# EAGLE design BLL-EBOOK-RpiZero (EAGLE 9.6.2)
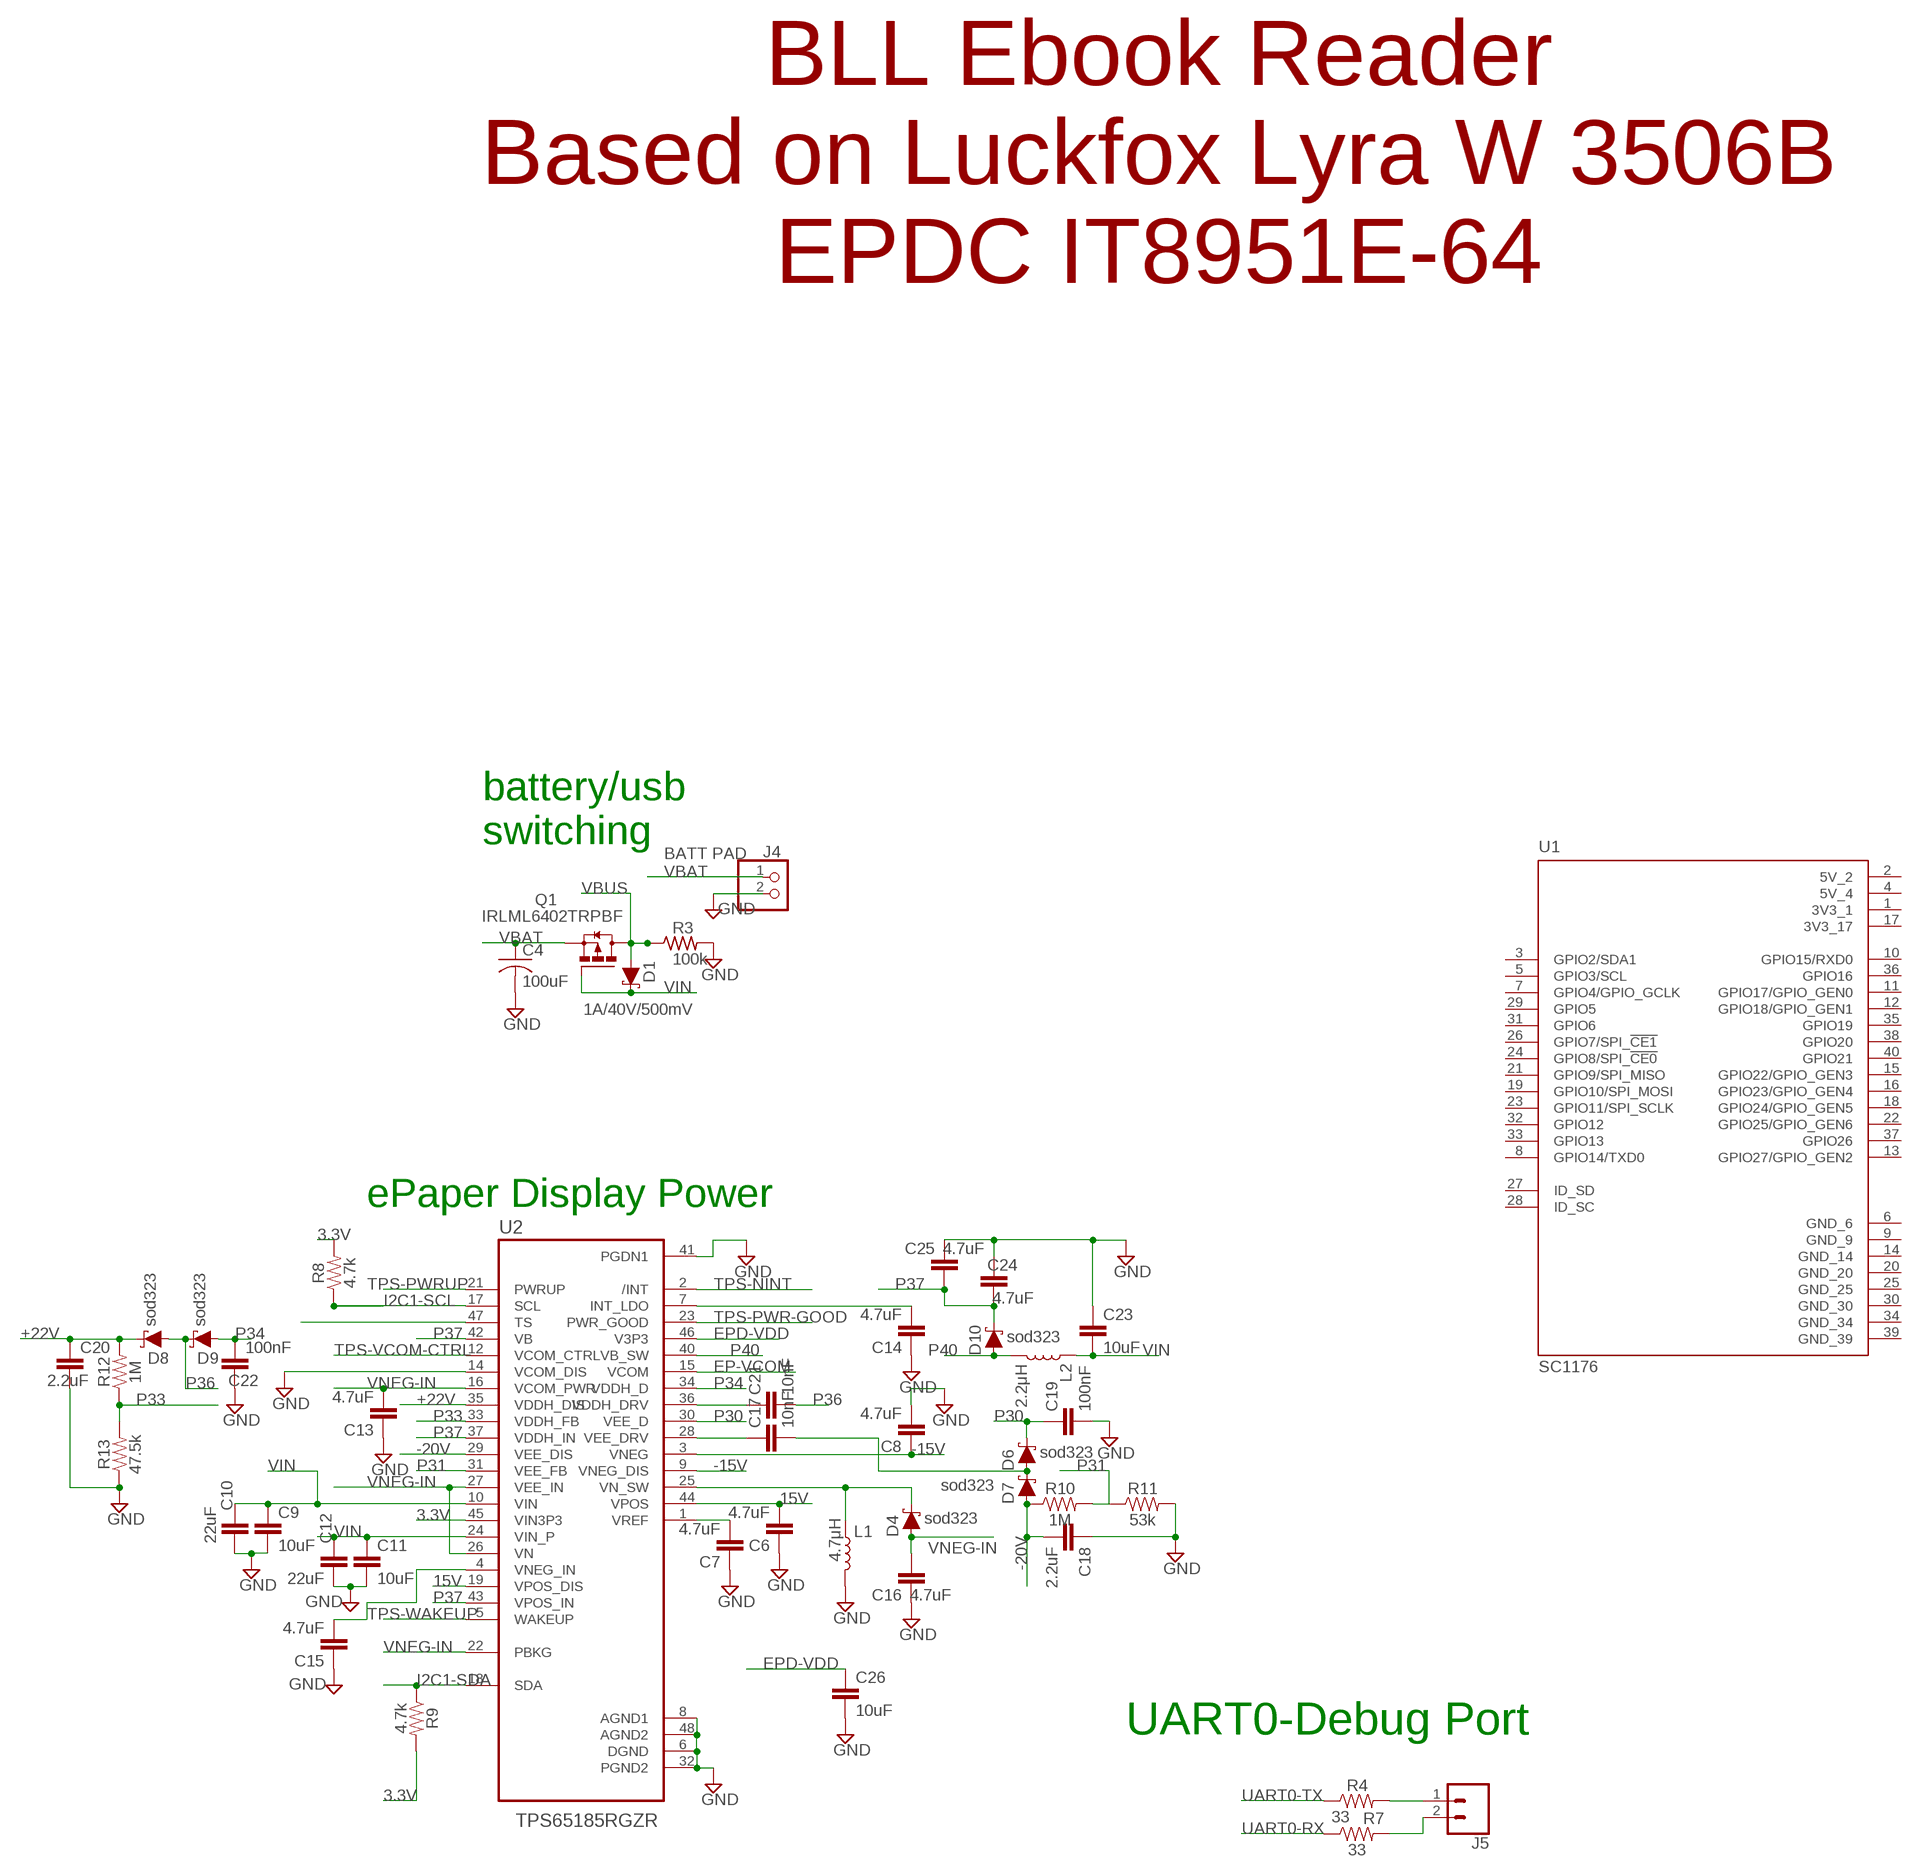
[diagram p0: schematic, sheet 1, part 1 of 2]
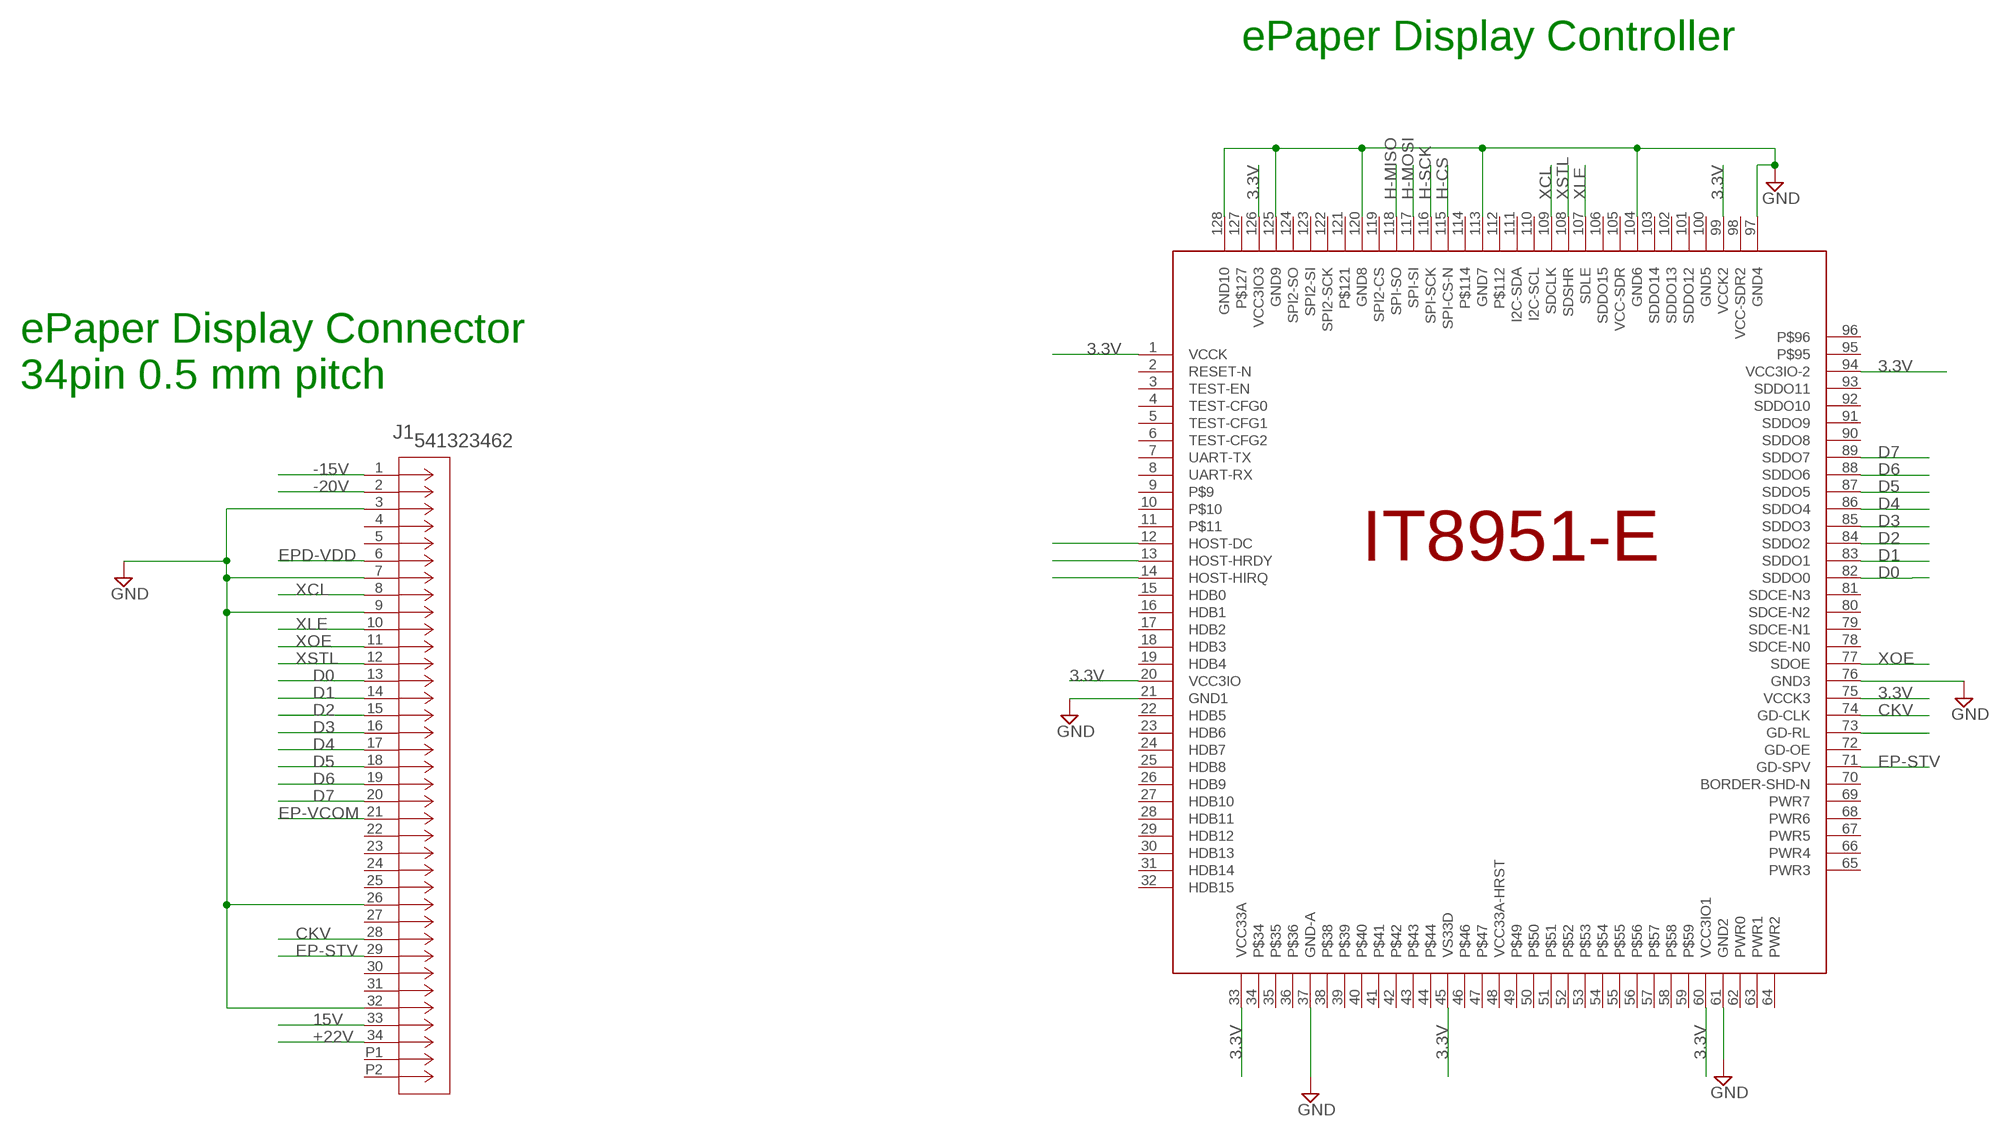
[diagram p1: schematic, sheet 1, part 2 of 2]

## Parts
C4  100uF  C-USC0603  [C0603]
C6  4.7uF  4.7UF-0603-35V-(20%)  [0603]
C7  4.7uF  4.7UF-0603-35V-(20%)  [0603]
C8  4.7uF  4.7UF-0603-35V-(20%)  [0603]
C9  10uF  10UF-0805-10V-10%  [0805]
C10  22uF  22UF-0805-16V-20%  [0805]
C11  10uF  10UF-0805-10V-10%  [0805]
C12  22uF  22UF-0805-16V-20%  [0805]
C13  4.7uF  4.7UF-0603-35V-(20%)  [0603]
C14  4.7uF  4.7UF-0603-35V-(20%)  [0603]
C15  4.7uF  4.7UF-0603-35V-(20%)  [0603]
C16  4.7uF  4.7UF-0603-35V-(20%)  [0603]
C17  10nF  10NF-0603-50V-10%  [0603]
C18  2.2uF  2.2UF-1206-50V-10%  [1206]
C19  100nF  DNP-0603  [0603]
C20  2.2uF  2.2UF-1206-50V-10%  [1206]
C21  10nF  10NF-0603-50V-10%  [0603]
C22  100nF  DNP-0603  [0603]
C23  10uF  10UF-0805-10V-10%  [0805]
C24  4.7uF  4.7UF-0603-35V-(20%)  [0603]
C25  4.7uF  4.7UF-0603-35V-(20%)  [0603]
C26  10uF  10UF-0805-10V-10%  [0805]
D1  1A/40V/500mV  DIODE-SCHOTTKY-SS14  [SMA-DIODE]
D4  sod323  DIODE-SCHOTTKY-PMEG4005EJ  [SOD-323]
D6  sod323  DIODE-SCHOTTKY-PMEG4005EJ  [SOD-323]
D7  sod323  DIODE-SCHOTTKY-PMEG4005EJ  [SOD-323]
D8  sod323  DIODE-SCHOTTKY-PMEG4005EJ  [SOD-323]
D9  sod323  DIODE-SCHOTTKY-PMEG4005EJ  [SOD-323]
D10  sod323  DIODE-SCHOTTKY-PMEG4005EJ  [SOD-323]
J1  541323462  [CON_541323462_MOL]
J4  BATT PAD  PINHD-1X2/90  [1X02/90]
J5  CONN_02LOCK  [1X02_LOCK]
L1  4.7μH  4.7μH_SHIELDED_INDUCTOR  [1008(2520)]
L2  2.2μH  2.2μH_SHIELDED_INDUCTOR  [0806]
Q1  IRLML6402TRPBF  [SOT23]
R3  100k  R-US_R0603  [R0603]
R4  33  33OHM-0603-1/10W-1%  [0603]
R7  33  33OHM-0603-1/10W-1%  [0603]
R8  4.7k  4.7KOHM-0603-1/10W-1%  [0603]
R9  4.7k  4.7KOHM-0603-1/10W-1%  [0603]
R10  1M  1MOHM-0603-1/4W-5%  [0603]
R11  53k  RESISTOR0805  [0805]
R12  1M  1MOHM-0603-1/4W-5%  [0603]
R13  47.5k  RESISTOR0805  [0805]
U1  SC1176  [MODULE_SC1176]
U2  TPS65185RGZR  [QFN50P700X700X100-49N]
U$1  IT8951  [LQFP128_STM]

## Nets
3.3V: R8.2 R9.2 U2.45(VIN3P3) U$1.1(VCCK) U$1.20(VCC3IO) U$1.33(VCC33A) U$1.45(VS33D) U$1.60(VCC3IO1) U$1.75(VCCK3) U$1.94(VCC3IO-2) U$1.99(VCCK2) U$1.126(VCC3IO3)
15V: C6.2 J1.33 U2.19(VPOS_DIS) U2.44(VPOS)
+22V: C20.1 D8.C J1.34 R12.2 U2.35(VDDH_DIS)
-15V: C8.1 J1.1 U2.3(VNEG) U2.9(VNEG_DIS)
-20V: C18.2 D7.A J1.2 R10.1 U2.29(VEE_DIS)
CKV: J1.28 U$1.74(GD-CLK)
D0: J1.13 U$1.82(SDDO0)
D1: J1.14 U$1.83(SDDO1)
D2: J1.15 U$1.84(SDDO2)
D3: J1.16 U$1.85(SDDO3)
D4: J1.17 U$1.86(SDDO4)
D5: J1.18 U$1.87(SDDO5)
D6: J1.19 U$1.88(SDDO6)
D7: J1.20 U$1.89(SDDO7)
EP-STV: J1.29 U$1.71(GD-SPV)
EP-VCOM: J1.21 U2.15(VCOM)
EPD-VDD: C26.1 J1.6 U2.46(V3P3)
GND: C4.2 C6.1 C7.1 C8.2 C9.2 C10.2 C11.2 C12.2 C13.1 C14.1 C15.1 C16.1 C18.1 C19.2 C20.2 C22.1 C23.1 C24.2 C25.2 C26.2 J1.3 J1.7 J1.9 J1.26 J1.32 J4.2 L1.2 R3.2 R11.2 R13.1 U2.6(DGND) U2.8(AGND1) U2.14(VCOM_DIS) U2.32(PGND2) U2.41(PGDN1) U2.48(AGND2) U$1.21(GND1) U$1.37(GND-A) U$1.61(GND2) U$1.76(GND3) U$1.97(GND4) U$1.104(GND6) U$1.113(GND7) U$1.120(GND8) U$1.125(GND9) U$1.128(GND10)
H-CS: U$1.115(SPI-CS-N)
H-MISO: U$1.118(SPI-SO)
H-MOSI: U$1.117(SPI-SI)
H-SCK: U$1.116(SPI-SCK)
I2C1-SCL: R8.1 U2.17(SCL)
I2C1-SDA: R9.1 U2.18(SDA)
N$6: J5.1 R4.2
N$7: U$1.73(GD-RL)
N$8: U$1.12(HOST-DC)
N$9: J5.2 R7.2
N$10: U$1.13(HOST-HRDY)
N$11: U2.47(TS)
N$12: C7.2 U2.1(VREF)
N$13: C15.2 U2.4(VNEG_IN)
N$14: C14.2 U2.7(INT_LDO)
N$15: D4.C L1.1 U2.25(VN_SW)
N$16: C17.1 U2.28(VEE_DRV)
N$17: C17.2 D6.A D7.C
N$19: C21.1 U2.36(VDDH_DRV)
N$22: U$1.14(HOST-HIRQ)
P30: C19.1 D6.C U2.30(VEE_D)
P31: R10.2 R11.1 U2.31(VEE_FB)
P33: R12.1 R13.2 U2.33(VDDH_FB)
P34: C22.2 D9.A U2.34(VDDH_D)
P36: C21.2 D8.A D9.C
P37: C24.1 C25.1 D10.C U2.37(VDDH_IN) U2.42(VB) U2.43(VPOS_IN)
P40: D10.A L2.2 U2.40(VB_SW)
TPS-NINT: U2.2(/INT)
TPS-PWR-GOOD: U2.23(PWR_GOOD)
TPS-PWRUP: U2.21(PWRUP)
TPS-VCOM-CTRL: U2.12(VCOM_CTRL)
TPS-WAKEUP: U2.5(WAKEUP)
UART0-RX: R7.1
UART0-TX: R4.1
VBAT: C4.1 J4.1 Q1.2(S)
VBUS: D1.A Q1.3(D) R3.1
VIN: C9.1 C10.1 C11.1 C12.1 C23.2 D1.C L2.1 Q1.1(G) U2.10(VIN) U2.24(VIN_P)
VNEG-IN: C13.2 C16.2 D4.A U2.16(VCOM_PWR) U2.22(PBKG) U2.26(VN) U2.27(VEE_IN)
XCL: J1.8 U$1.109(SDCLK)
XLE: J1.10 U$1.107(SDLE)
XOE: J1.11 U$1.77(SDOE)
XSTL: J1.12 U$1.108(SDSHR)
Unconnected: J1.4 J1.5 J1.22 J1.23 J1.24 J1.25 J1.27 J1.30 J1.31 J1.P1 J1.P2 U1.3(GPIO2/SDA1) U1.5(GPIO3/SCL) U1.7(GPIO4/GPIO_GCLK) U1.8(GPIO14/TXD0) U1.10(GPIO15/RXD0) U1.11(GPIO17/GPIO_GEN0) U1.12(GPIO18/GPIO_GEN1) U1.13(GPIO27/GPIO_GEN2) U1.15(GPIO22/GPIO_GEN3) U1.16(GPIO23/GPIO_GEN4) U1.18(GPIO24/GPIO_GEN5) U1.19(GPIO10/SPI_MOSI) U1.21(GPIO9/SPI_MISO) U1.22(GPIO25/GPIO_GEN6) U1.23(GPIO11/SPI_SCLK) U1.24(GPIO8/SPI_!CE0!) U1.26(GPIO7/SPI_!CE1!) U1.27(ID_SD) U1.28(ID_SC) U1.29(GPIO5) U1.31(GPIO6) U1.32(GPIO12) U1.33(GPIO13) U1.35(GPIO19) U1.36(GPIO16) U1.37(GPIO26) U1.38(GPIO20) U1.40(GPIO21) U$1.2(RESET-N) U$1.3(TEST-EN) U$1.4(TEST-CFG0) U$1.5(TEST-CFG1) U$1.6(TEST-CFG2) U$1.7(UART-TX) U$1.8(UART-RX) U$1.9 U$1.10 U$1.11 U$1.15(HDB0) U$1.16(HDB1) U$1.17(HDB2) U$1.18(HDB3) U$1.19(HDB4) U$1.22(HDB5) U$1.23(HDB6) U$1.24(HDB7) U$1.25(HDB8) U$1.26(HDB9) U$1.27(HDB10) U$1.28(HDB11) U$1.29(HDB12) U$1.30(HDB13) U$1.31(HDB14) U$1.32(HDB15) U$1.34 U$1.35 U$1.36 U$1.38 U$1.39 U$1.40 U$1.41 U$1.42 U$1.43 U$1.44 U$1.46 U$1.47 U$1.48(VCC33A-HRST) U$1.49 U$1.50 U$1.51 U$1.52 U$1.53 U$1.54 U$1.55 U$1.56 U$1.57 U$1.58 U$1.59 U$1.62(PWR0) U$1.63(PWR1) U$1.64(PWR2) U$1.65(PWR3) U$1.66(PWR4) U$1.67(PWR5) U$1.68(PWR6) U$1.69(PWR7) U$1.70(BORDER-SHD-N) U$1.72(GD-OE) U$1.78(SDCE-N0) U$1.79(SDCE-N1) U$1.80(SDCE-N2) U$1.81(SDCE-N3) U$1.90(SDDO8) U$1.91(SDDO9) U$1.92(SDDO10) U$1.93(SDDO11) U$1.95 U$1.96 U$1.98(VCC-SDR2) U$1.100(GND5) U$1.101(SDDO12) U$1.102(SDDO13) U$1.103(SDDO14) U$1.105(VCC-SDR) U$1.106(SDDO15) U$1.110(I2C-SCL) U$1.111(I2C-SDA) U$1.112 U$1.114 U$1.119(SPI2-CS) U$1.121 U$1.122(SPI2-SCK) U$1.123(SPI2-SI) U$1.124(SPI2-SO) U$1.127

## Notes on the sheet
- BLL Ebook Reader
  Based on Luckfox Lyra W 3506B
  EPDC IT8951E-64
- ePaper Display Controller
- ePaper Display Connector
  34pin 0.5 mm pitch
- battery/usb 
  switching
- ePaper Display Power
- UART0-Debug Port

## Power pins joined to a net without a drawn wire
3V3_1: U1.1(3V3_1)
3V3_17: U1.17(3V3_17)
5V_2: U1.2(5V_2)
5V_4: U1.4(5V_4)
GND_6: U1.6(GND_6)
GND_9: U1.9(GND_9)
GND_14: U1.14(GND_14)
GND_20: U1.20(GND_20)
GND_25: U1.25(GND_25)
GND_30: U1.30(GND_30)
GND_34: U1.34(GND_34)
GND_39: U1.39(GND_39)

## Library data of the parts
C4 = rcl:C-US: CAPACITOR, American symbol; SPICEPREFIX: C
C6-C8 C13-C16 C24 C25 = SparkFun-Capacitors:4.7UF: 4.7µF ceramic capacitors A capacitor is a passive two-terminal electrical component used to store electrical energy temporarily in an electric field.; PROD_ID: CAP-14106
C9 C11 C23 C26 = SparkFun-Capacitors:10UF: 10.0µF ceramic capacitors A capacitor is a passive two-terminal electrical component used to store electrical energy temporarily in an electric field.; PROD_ID: CAP-11330
C10 C12 = SparkFun-Capacitors:22UF: 22µF ceramic capacitors A capacitor is a passive two-terminal electrical component used to store electrical energy temporarily in an electric field.; PROD_ID: CAP-14260
C17 C21 = SparkFun-Capacitors:10NF: 0.01uF/10nF/10,000pF ceramic capacitors A capacitor is a passive two-terminal electrical component used to store electrical energy temporarily in an electric field. CAP-09321; PROD_ID: CAP-00867
C18 C20 = SparkFun-Capacitors:2.2UF: 2.2µF ceramic capacitors A capacitor is a passive two-terminal electrical component used to store electrical energy temporarily in an electric field.; PROD_ID: CAP-10009
C19 C22 = SparkFun-Capacitors:DNP: Do-Not-Populate capacitor; VALUE: DNP
D1 = SparkFun-DiscreteSemi:DIODE-SCHOTTKY: Schottky diode A Schottky diode is a semiconductor diode which has a low forward voltage drop and a very fast switching action.; PROD_ID: DIO-08053
D4 D6-D10 = SparkFun-DiscreteSemi:DIODE-SCHOTTKY: Schottky diode A Schottky diode is a semiconductor diode which has a low forward voltage drop and a very fast switching action.; PROD_ID: DIO-10955; VALUE: 0.5A/40V/420mV
J1 = molex fpc 34p 0.5mm :541323462: Check availability <https://pricing.snapeda.com/parts/541323462/Molex/view-part?ref=eda>; AVAILABILITY: In Stock; CHECK_PRICES: https://www.snapeda.com/parts/541323462/Molex/view-part/?ref=eda; DESCRIPTION: 34 Position FFC, FPC Connector Contacts, Bottom 0.020 (0.50mm) Surface Mount, Right Angle; MF: Molex; MP: 541323462; PACKAGE: None; PRICE: None; SNAPEDA_LINK: https://www.snapeda.com/parts/541323462/Molex/view-part/?ref=snap
J4 = pinhead:PINHD-1X2: PIN HEADER
J5 = SparkFun-Connectors:CONN_02: Multi connection point. Often used as Generic Header-pin footprint for 0.1 inch spaced/style header connections On any of the 0.1 inch spaced packages, you can populate with these: Break Away Headers - Straight <https://www.sparkfun.com/products/116> (PRT-00116) Break Away Male Headers - Right Angle <https://www.sparkfun.com/products/553> (PRT-00553) Female Headers <https://www.sparkfun.com/products/115> (PRT-00115) Break Away Headers - Machine Pin <https://www.sparkfun.com/products/117> (PRT-00117) Break Away Female Headers - Swiss Machine Pin <https://www.sparkfun.com/products/743> (PRT-00743) For SCREWTERMINALS and SPRING TERMINALS visit here: Screw Terimnals on SparkFun.com <https://www.sparkfun.com/search/results?term=Screw+Terminals> (5mm/3.5mm/2.54mm spacing) This device is also useful as a general connection point to wire up your design to another part of your project. Our various solder wires solder well into these plated through hole pads. Hook-Up Wire - Assortment (Stranded, 22 AWG) <https://www.sparkfun.com/products/11375> (PRT-11375) Hook-Up Wire - Assortment (Solid Core, 22 AWG) <https://www.sparkfun.com/products/11367> (PRT-11367) View the entire wire category on our website here <https://www.sparkfun.com/categories/141> Special notes: Molex polarized connector foot print use with: PRT-08233 with associated crimp pins and housings. 2.54_SCREWTERM for use with PRT-10571. 3.5mm Screw Terminal footprints for PRT-08084 5mm Screw Terminal footprints for use with PRT-08432
L1 = SparkFun-Coils:4.7μH_SHIELDED_INDUCTOR: 4.7uH Inductor 4.7uH 1.4A 50mOhm 1008(2520) Package Shielded; PROD_ID: NDUC-14880
L2 = SparkFun-Coils:2.2μH_SHIELDED_INDUCTOR: Murata 2.2uH Inductor 2.2uH 1.2A 110mOhm 0806 Package Shielded Bourns 2.2uH Inductor 2.2uH 5.5A 205mOhm 5x5mm Package Shielded; PROD_ID: NDUC-14257
Q1 = IRLML6402:IRLML6402: Check availability <https://pricing.snapeda.com/parts/IRLML6402/Infineon%20Technologies/view-part?ref=eda>; AVAILABILITY: In Stock; CHECK_PRICES: https://www.snapeda.com/parts/IRLML6402/Infineon/view-part/?ref=eda; DESCRIPTION: P-Channel 20 V 3.7A (Ta) 1.3W (Ta) Surface Mount Micro3â„¢ /SOT-23; MF: Infineon Technologies; MP: IRLML6402; PACKAGE: SOT-23-3 ON Semiconductor; PRICE: None; SNAPEDA_LINK: https://www.snapeda.com/parts/IRLML6402/Infineon/view-part/?ref=snap
R3 = rcl:R-US_: RESISTOR, American symbol; SPICEPREFIX: R
R4 R7 = SparkFun-Resistors:33OHM: 33Ω resistor A resistor is a passive two-terminal electrical component that implements electrical resistance as a circuit element. Resistors act to reduce current flow, and, at the same time, act to lower voltage levels within circuits. - Wikipedia; PROD_ID: RES-08270
R8 R9 = SparkFun-Resistors:4.7KOHM: 4.7kΩ resistor A resistor is a passive two-terminal electrical component that implements electrical resistance as a circuit element. Resistors act to reduce current flow, and, at the same time, act to lower voltage levels within circuits. - Wikipedia; PROD_ID: RES-07857
R10 R12 = SparkFun-Resistors:1MOHM: 1MΩ resistor A resistor is a passive two-terminal electrical component that implements electrical resistance as a circuit element. Resistors act to reduce current flow, and, at the same time, act to lower voltage levels within circuits. - Wikipedia; PROD_ID: RES-07868
R11 R13 = SparkFun-Resistors:RESISTOR: Generic Resistor Package
U1 = RPiZ2W:SC1176: Check availability <https://pricing.snapeda.com/parts/SC1176/Raspberry%20Pi/view-part?ref=eda>; AVAILABILITY: In Stock; CHECK_PRICES: https://www.snapeda.com/parts/SC1176/Raspberry+Pi/view-part/?ref=eda; DESCRIPTION: The Raspberry Pi Zero 2 W SC1176 single board computer features a 1GHz quad-core Broadcom BCM2710A1 Arm Cortex-A53 processor and 512MB of RAM, making it a powerful solution for embedded computing applications. With 40 digital I/O lines and multiple expansion options including Bluetooth 4.2, BLE, HAT GPIO, and LAN, this SBC offers extensive connectivity and flexibility. Its compact size of 2.600 x 1.180 (66.04mm x 29.97mm) makes it ideal for space-constrained projects. Video outputs include Composite and HDMI, and it features a microSD storage interface and a USB 2.0 OTG port.; MF: Raspberry Pi; MP: SC1176; PACKAGE: None; PRICE: None; SNAPEDA_LINK: https://www.snapeda.com/parts/SC1176/Raspberry+Pi/view-part/?ref=snap
U2 = TPS65185RGZR:TPS65185RGZR: Check availability <https://pricing.snapeda.com/parts/TPS65185RGZR/Texas%20Instruments/view-part?ref=eda>; AVAILABILITY: In Stock; CHECK_PRICES: https://www.snapeda.com/parts/TPS65185RGZR/Texas+Instruments/view-part/?ref=eda; DESCRIPTION: PMIC for E-Ink® Vizplex™ Enabled Electronic Paper Display w/ Active Discharge; MF: Texas Instruments; MP: TPS65185RGZR; PACKAGE: VQFN-48 Texas Instruments; PRICE: None; SNAPEDA_LINK: https://www.snapeda.com/parts/TPS65185RGZR/Texas+Instruments/view-part/?ref=snap
U$1 = it8951E:IT8951: Controlador de alto rendimiento y bajo costo para EPDs (Electronic Paper Displays) con soporte para VCOM AC/DC. Integra funciones como auto-display al arranque, alpha blending y picture-in-picture para reducir la carga del host. Compatible con resoluciones flexibles hasta 2048×2048 y equipado con 32/64 Mb de SDRAM interna. Interfaces disponibles: SPI, I²C, USB, Intel 80 y Motorola 68. Ideal para aplicaciones embebidas con pantallas e-paper monocromáticas o en escala de grises

## Board
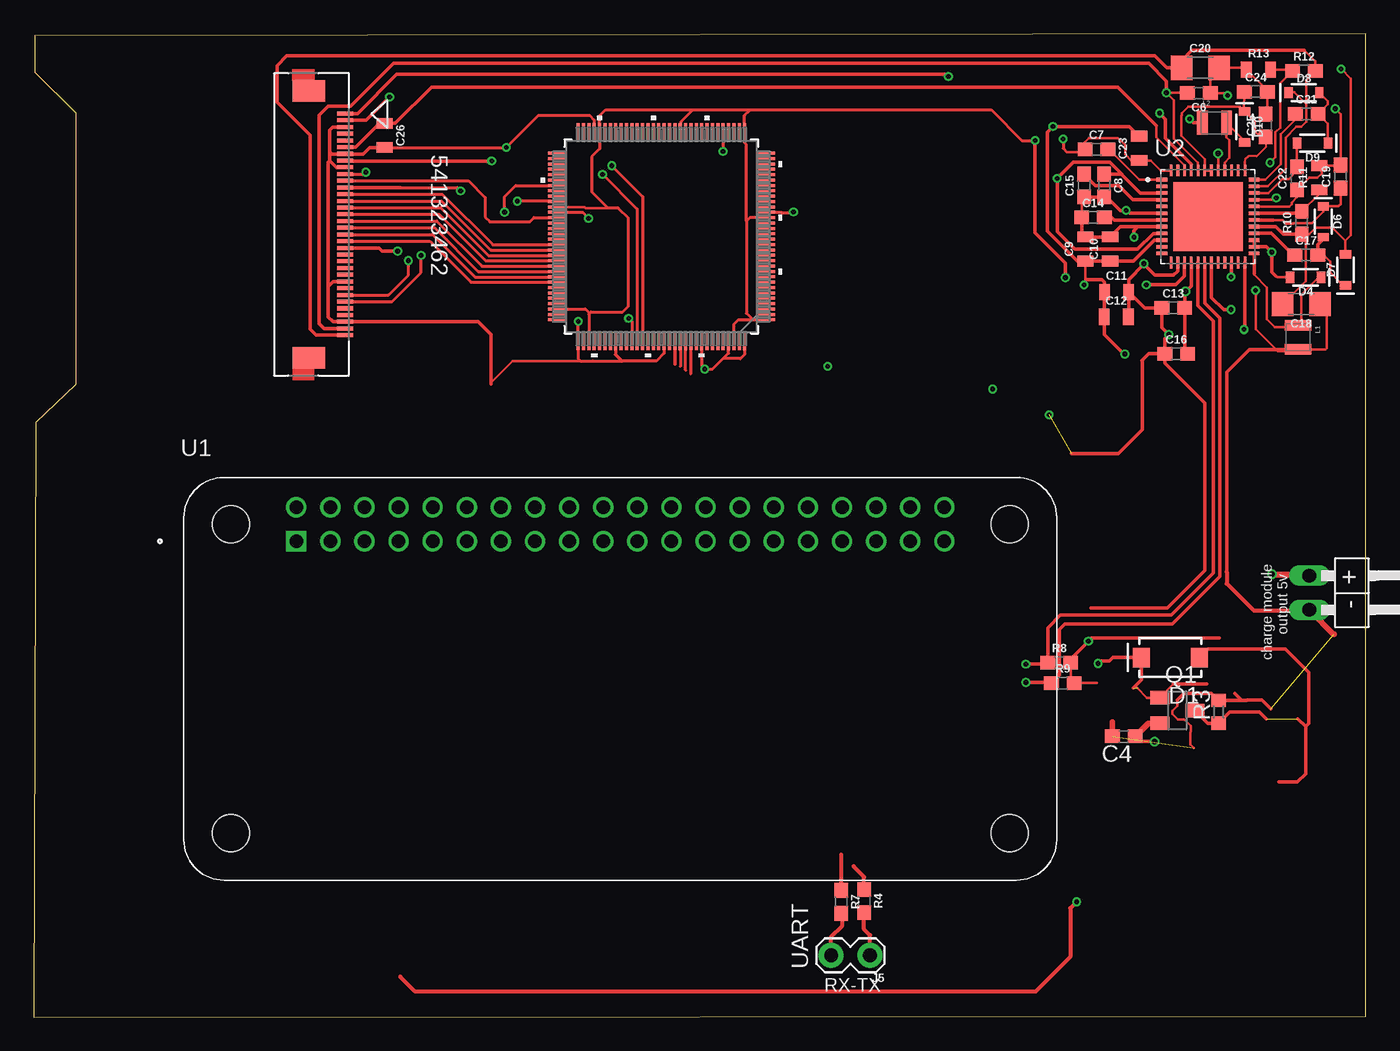
[diagram p2: board, top side]
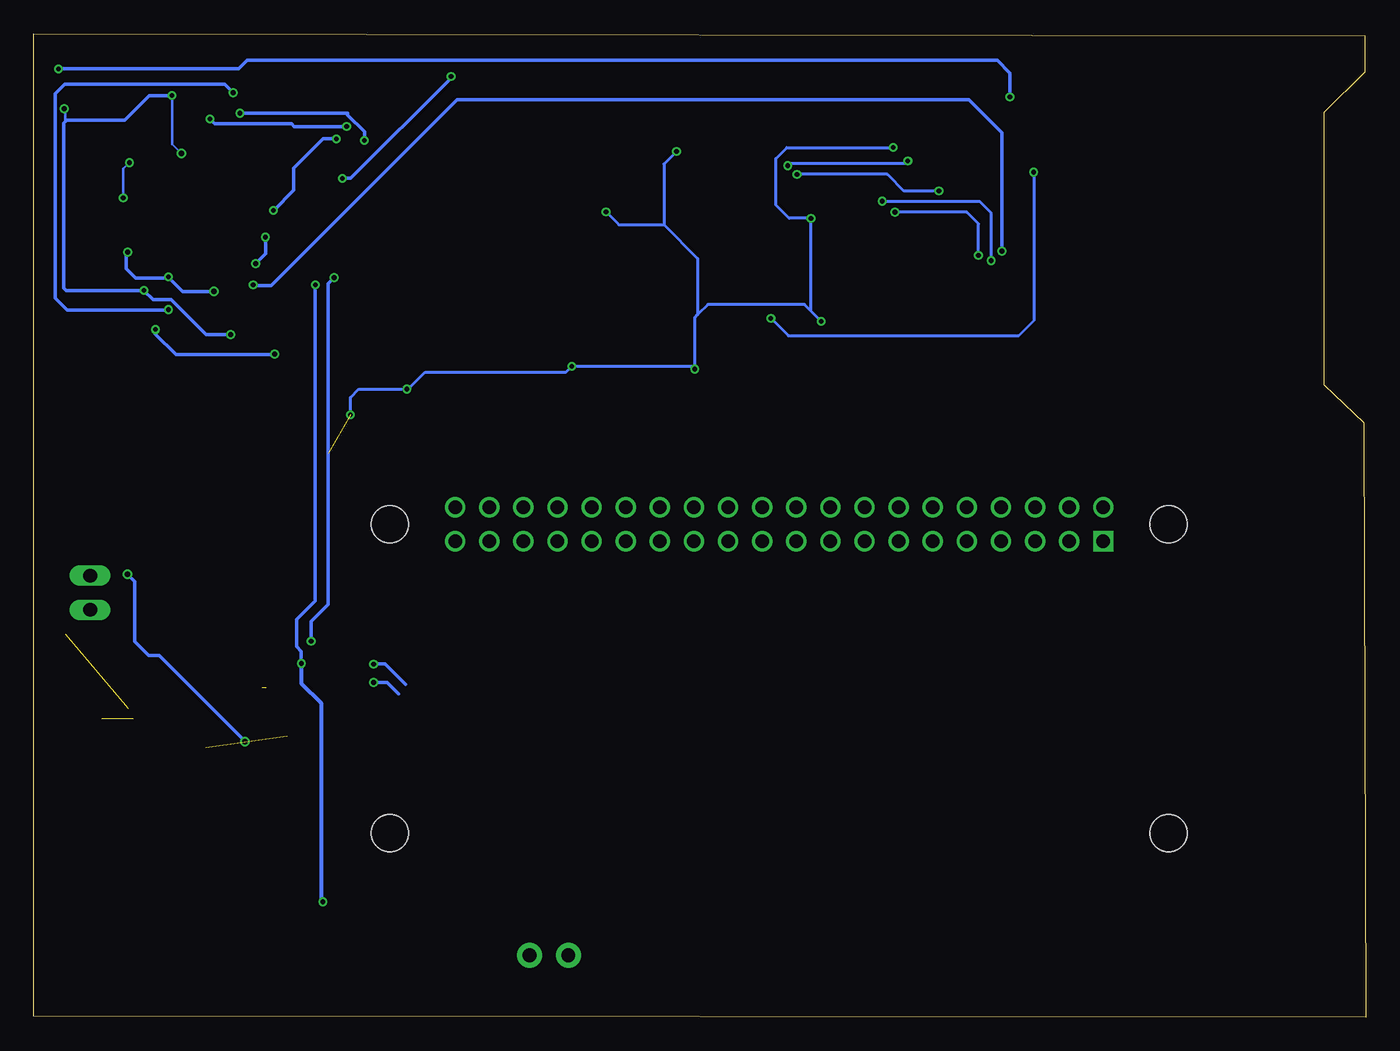
[diagram p3: board, bottom side, seen from below]

Size 99.21 x 73.24 mm. Coordinates in mm from the lower left corner, seen from the top.
Outline: 0,0 99.19,0.05 99.21,73.24 0.1,73.09 0.1,70.36 3.12,67.34 3.12,47.12 0.15,44.27 0,0
Copper layers (1*16): Top 0.035mm / dielectric 1.5mm / Bottom 0.035mm
Design rules "default *": minimum track width 6.5mil, minimum drill 0.15mm, track to track 6.5mil, track to pad 0.1mm, pad to pad 0.15mm, via to via 6mil, smd to smd 0.15mm, copper to edge 40mil, drill to drill 0.2mm, minimum pad ring 10mil, minimum via ring 0.15mm, stop-mask expansion 4mil, vias tented up to drill 0mil, thermal gap 10mil

### Footprints (pad centres in the part's own frame; a part is rotated, then mirrored left to right if it is on the bottom)
C0603 = smd 1.1 x 1: 1 -0.85,0; 2 0.85,0
0603 = smd 1.1 x 1: 1 -0.85,0; 2 0.85,0
0805 = smd 0.8 x 1.2: 1 -0.9,0; 2 0.9,0
1206 = smd 1.6 x 1.8: 1 -1.4,0; 2 1.4,0
SMA-DIODE = smd 1.27 x 1.47: A -2.15,0; C 2.15,0
SOD-323 = smd 0.63 x 0.83: A 1.15,0; C -1.15,0
CON_541323462_MOL = smd 0.3 x 1.2: 1 -8.25,2.498; 2 -7.75,2.498; 3 -7.25,2.498; 4 -6.75,2.498; 5 -6.25,2.498; 6 -5.75,2.498; 7 -5.25,2.498; 8 -4.75,2.498; 9 -4.25,2.498; 10 -3.75,2.498; 11 -3.25,2.498; 12 -2.75,2.498; 13 -2.25,2.498; 14 -1.75,2.498; 15 -1.25,2.498; 16 -0.75,2.498; 17 -0.25,2.498; 18 0.25,2.498; 19 0.75,2.498; 20 1.25,2.498; 21 1.75,2.498; 22 2.25,2.498; 23 2.75,2.498; 24 3.25,2.498; 25 3.75,2.498; 26 4.25,2.498; 27 4.75,2.498; 28 5.25,2.498; 29 5.75,2.498; 30 6.25,2.498; 31 6.75,2.498; 32 7.25,2.498; 33 7.75,2.498; 34 8.25,2.498 | smd 1.6 x 2.4: P1 -9.95,-0.202; P2 9.95,-0.202
1X02/90 = drill 1.016 long: 1 -1.27,-3.81; 2 1.27,-3.81
1X02_LOCK = drill 1.016 pad 1.88: 1 -0.178,0; 2 2.718,0
1008(2520) = smd 0.8 x 2: 1 -0.9,0; 2 0.9,0
0806 = smd 0.8 x 1.8: 1 -0.9,0; 2 0.9,0
SOT23 = smd 1 x 1.4: 1 -0.95,-1.306; 2 0.95,-1.306; 3 0,1.306
R0603 = smd 1 x 1.1: 1 -0.85,0; 2 0.85,0
MODULE_SC1176 = drill 1 square: 1 -24.13,10.23 | drill 1: 2 -24.13,12.77; 3 -21.59,10.23; 4 -21.59,12.77; 5 -19.05,10.23; 6 -19.05,12.77; 7 -16.51,10.23; 8 -16.51,12.77; 9 -13.97,10.23; 10 -13.97,12.77; 11 -11.43,10.23; 12 -11.43,12.77; 13 -8.89,10.23; 14 -8.89,12.77; 15 -6.35,10.23; 16 -6.35,12.77; 17 -3.81,10.23; 18 -3.81,12.77; 19 -1.27,10.23; 20 -1.27,12.77; 21 1.27,10.23; 22 1.27,12.77; 23 3.81,10.23; 24 3.81,12.77; 25 6.35,10.23; 26 6.35,12.77; 27 8.89,10.23; 28 8.89,12.77; 29 11.43,10.23; 30 11.43,12.77; 31 13.97,10.23; 32 13.97,12.77; 33 16.51,10.23; 34 16.51,12.77; 35 19.05,10.23; 36 19.05,12.77; 37 21.59,10.23; 38 21.59,12.77; 39 24.13,10.23; 40 24.13,12.77 | hole 2.75: -29,-11.5; -29,11.5; 29,-11.5; 29,11.5
QFN50P700X700X100-49N = smd 0.86 x 0.26: 1 -3.435,2.75; 2 -3.435,2.25; 3 -3.435,1.75; 4 -3.435,1.25; 5 -3.435,0.75; 6 -3.435,0.25; 7 -3.435,-0.25; 8 -3.435,-0.75; 9 -3.435,-1.25; 10 -3.435,-1.75; 11 -3.435,-2.25; 12 -3.435,-2.75; 25 3.435,-2.75; 26 3.435,-2.25; 27 3.435,-1.75; 28 3.435,-1.25; 29 3.435,-0.75; 30 3.435,-0.25; 31 3.435,0.25; 32 3.435,0.75; 33 3.435,1.25; 34 3.435,1.75; 35 3.435,2.25; 36 3.435,2.75 | smd 0.26 x 0.86: 13 -2.75,-3.435; 14 -2.25,-3.435; 15 -1.75,-3.435; 16 -1.25,-3.435; 17 -0.75,-3.435; 18 -0.25,-3.435; 19 0.25,-3.435; 20 0.75,-3.435; 21 1.25,-3.435; 22 1.75,-3.435; 23 2.25,-3.435; 24 2.75,-3.435; 37 2.75,3.435; 38 2.25,3.435; 39 1.75,3.435; 40 1.25,3.435; 41 0.75,3.435; 42 0.25,3.435; 43 -0.25,3.435; 44 -0.75,3.435; 45 -1.25,3.435; 46 -1.75,3.435; 47 -2.25,3.435; 48 -2.75,3.435 | smd 5.15 x 5.15: 49 0,0
LQFP128_STM = smd 1.353 x 0.229: 1 -7.776,6.2; 2 -7.776,5.8; 3 -7.776,5.4; 4 -7.776,5; 5 -7.776,4.6; 6 -7.776,4.2; 7 -7.776,3.8; 8 -7.776,3.4; 9 -7.776,3; 10 -7.776,2.6; 11 -7.776,2.2; 12 -7.776,1.8; 13 -7.776,1.4; 14 -7.776,1; 15 -7.776,0.6; 16 -7.776,0.2; 17 -7.776,-0.2; 18 -7.776,-0.6; 19 -7.776,-1; 20 -7.776,-1.4; 21 -7.776,-1.8; 22 -7.776,-2.2; 23 -7.776,-2.6; 24 -7.776,-3; 25 -7.776,-3.4; 26 -7.776,-3.8; 27 -7.776,-4.2; 28 -7.776,-4.6; 29 -7.776,-5; 30 -7.776,-5.4; 31 -7.776,-5.8; 32 -7.776,-6.2; 65 7.776,-6.2; 66 7.776,-5.8; 67 7.776,-5.4; 68 7.776,-5; 69 7.776,-4.6; 70 7.776,-4.2; 71 7.776,-3.8; 72 7.776,-3.4; 73 7.776,-3; 74 7.776,-2.6; 75 7.776,-2.2; 76 7.776,-1.8; 77 7.776,-1.4; 78 7.776,-1; 79 7.776,-0.6; 80 7.776,-0.2; 81 7.776,0.2; 82 7.776,0.6; 83 7.776,1; 84 7.776,1.4; 85 7.776,1.8; 86 7.776,2.2; 87 7.776,2.6; 88 7.776,3; 89 7.776,3.4; 90 7.776,3.8; 91 7.776,4.2; 92 7.776,4.6; 93 7.776,5; 94 7.776,5.4; 95 7.776,5.8; 96 7.776,6.2 | smd 0.229 x 1.353: 33 -6.2,-7.776; 34 -5.8,-7.776; 35 -5.4,-7.776; 36 -5,-7.776; 37 -4.6,-7.776; 38 -4.2,-7.776; 39 -3.8,-7.776; 40 -3.4,-7.776; 41 -3,-7.776; 42 -2.6,-7.776; 43 -2.2,-7.776; 44 -1.8,-7.776; 45 -1.4,-7.776; 46 -1,-7.776; 47 -0.6,-7.776; 48 -0.2,-7.776; 49 0.2,-7.776; 50 0.6,-7.776; 51 1,-7.776; 52 1.4,-7.776; 53 1.8,-7.776; 54 2.2,-7.776; 55 2.6,-7.776; 56 3,-7.776; 57 3.4,-7.776; 58 3.8,-7.776; 59 4.2,-7.776; 60 4.6,-7.776; 61 5,-7.776; 62 5.4,-7.776; 63 5.8,-7.776; 64 6.2,-7.776; 97 6.2,7.776; 98 5.8,7.776; 99 5.4,7.776; 100 5,7.776; 101 4.6,7.776; 102 4.2,7.776; 103 3.8,7.776; 104 3.4,7.776; 105 3,7.776; 106 2.6,7.776; 107 2.2,7.776; 108 1.8,7.776; 109 1.4,7.776; 110 1,7.776; 111 0.6,7.776; 112 0.2,7.776; 113 -0.2,7.776; 114 -0.6,7.776; 115 -1,7.776; 116 -1.4,7.776; 117 -1.8,7.776; 118 -2.2,7.776; 119 -2.6,7.776; 120 -3,7.776; 121 -3.4,7.776; 122 -3.8,7.776; 123 -4.2,7.776; 124 -4.6,7.776; 125 -5,7.776; 126 -5.4,7.776; 127 -5.8,7.776; 128 -6.2,7.776

### Placement (x,y rotation side)
C4  81.18,20.9 180 top
C6  86.77,68.81 180 top
C7  79.15,64.62 0 top
C8  79.73,61.93 270 top
C9  78.31,57.2 90 top
C10  80.16,57.2 90 top
C11  80.64,54 0 top
C12  80.62,52.15 0 top
C13  84.86,52.81 0 top
C14  78.89,59.54 0 top
C15  78.23,61.93 90 top
C16  85.09,49.38 0 top
C17  94.77,56.74 0 top
C18  94.39,53.09 180 top
C19  97.33,62.59 90 top
C20  86.87,70.69 0 top
C21  94.79,67.26 0 top
C22  94.08,62.46 90 top
C23  82.32,64.69 90 top
C24  91.01,68.91 0 top
C25  91.74,66.4 90 top
C26  26.14,65.66 270 top
D1  84.65,26.77 180 top
D4  94.72,55.09 180 top
D6  96.04,59.23 270 top
D7  97.69,55.65 90 top
D8  94.59,68.83 0 top
D9  95.22,65.07 180 top
D10  90.17,66.29 270 top
J1  20.7,59.03 270 top
J4  98.81,31.6 270 top
J5  62.1,4.6 180 top
L1  94.16,50.62 270 top
L2  87.93,66.6 0 top
Q1  85.17,22.83 270 top
R3  88.24,22.73 90 top
R4  61.85,8.64 270 top
R7  60.15,8.59 270 top
R8  76.38,26.39 0 top
R9  76.63,24.87 0 top
R10  94.44,59.16 90 top
R11  95.73,62.51 90 top
R12  94.59,70.46 0 top
R13  91.21,70.56 0 top
U1  43.69,25.2 0 top
U2  87.45,59.61 0 top
U$1  46.75,58.13 180 top

### Tracks (layer width: path | path; a pad name or v marks a point on that pad's centre or on a via)
3.3V  (via drill 0.35)
  Top 0.203: U2.45 86.2,63.53 | R9.2 79.16,24.87 | 77.23,25.12 R8.2 77.23,26.68 | U$1.75 38.99,60.31 41.04,60.31 41.09,60.26 42.77,60.26 42.55,60.48
  Top 0.229: U$1.33 52.95,66.24 | 52.95,66.24 52.95,67.15 53.37,67.56 | U$1.20 53.33,59.53 53.09,59.28 | 53.09,59.28 53.09,52.43 53.58,51.93 | 53.58,51.93 U$1.1 | U$1.126 52.15,51.59 52.49,51.93 53.58,51.93 | U$1.94 41.1,52.73 41.35,52.48 41.35,52.35 | 41.35,52.35 U$1.99 | 42.77,60.26 43.52,60.26 44.3,59.48 44.3,52.93 43.87,52.5 41.5,52.5 41.35,52.35 | U$1.45 48.22,65.98 48.22,66.67 49.12,67.56 | 49.12,67.56 53.37,67.56 | 53.37,67.56 71.32,67.56 73.61,65.28 v74.57,65.28 | 52.95,66.24 52.93,66.23 52.93,65.13 53.09,64.97 53.09,59.28 | 49.12,67.56 42.6,67.56 42.15,67.12 U$1.60 42.15,64.65 41.55,64.06 41.55,61.47 42.55,60.48 42.69,60.33
  Top 0.254: v76.83,55.07 76.83,56.16 74.57,58.42 v74.57,65.28 | v83.84,67.31 84.28,66.88 84.28,65.46 86.2,63.53 | 88.29,28.22 78.77,28.22 v78.54,27.99 77.23,26.68 | 77.23,25.12 R9.2
  Bottom 0.254: 78.51,27.97 v78.54,27.99 78.54,29.46 77.27,30.73 77.27,54.61 76.83,55.04 v76.83,55.07 | v74.57,65.28 74.57,65.94 75.82,67.18 75.82,67.31 v83.84,67.31
15V  (via drill 0.35)
  Top 0.203: C6.2 85.89,68.83 v84.35,68.83 84.92,68.27 84.92,65.43 86.7,63.65 U2.44
  Top 0.254: v89.18,52.68 88.62,52.68 87.7,53.6 U2.19 | J1.33 21.62,51.28 21.26,51.64 21.26,67.16 21.92,67.82 23.62,67.82 26.82,71.02 83.03,71.02 84.35,69.7 v84.35,68.83
  Bottom 0.254: v84.35,68.83 84.99,69.47 96.88,69.47 97.59,68.76 97.59,53.54 96.7,52.65 89.2,52.65 v89.18,52.68
+22V
  Top 0.203: 94.77,67.97 94.77,66.67 94.39,66.3 94.04,66.3 93.24,65.51 93.24,63.19 91.91,61.86 U2.35 | 94.62,71.99 95.44,71.17 R12.2 94.77,69.79 94.77,67.97 | D8.C 93.44,68.86 93.88,68.86 94.77,67.97
  Top 0.254: J1.34 21.05,50.78 20.6,51.23 20.6,65.66 18.14,68.12 18.14,70.87 18.85,71.58 83.49,71.58 84.38,70.69 C20.1 85.47,71.2 86.26,71.99 94.62,71.99
-15V  (via drill 0.35)
  Top 0.25: U2.9 83.37,58.36 82.19,57.18 77.55,57.18 76.22,58.5 v76.22,62.46
  Top 0.254: U2.3 82.43,61.36 81.01,62.77 | 81.01,62.77 81.04,62.77 80.14,63.68 77.44,63.68 v76.22,62.46 | 81.01,62.77 C8.1 | J1.1 24.11,67.28 27.03,70.2 68,70.2 68.15,70.05 v68.12,70.05
  Bottom 0.254: v68.12,70.05 68.12,69.93 75.59,62.46 v76.22,62.46
-20V  (via drill 0.35)
  Top 0.203: C18.2 93.01,53.09 94.74,54.81 94.74,58.01 R10.1 95.01,58.31 95.48,58.78 96.72,58.78 97.68,57.82 | D7.A 97.69,57.81 97.68,57.82 | v97.36,70.61 98.09,69.88 98.09,59.03 98.09,58.24 97.68,57.82
  Top 0.254: v26.52,68.53 24.77,66.78 J1.2 | R10.1 93.07,58.31 92.51,58.86 U2.29
  Bottom 0.254: v97.36,70.61 84.4,70.61 83.94,70.61 83.31,71.24 27.45,71.24 26.52,70.31 v26.52,68.53
CKV  (via drill 0.35)
  Top 0.229: J1.28 26.42,53.78 27.91,55.27 v27.91,56.34 | v36.02,60.76 38.95,60.76 U$1.74
  Bottom 0.229: v27.91,56.34 27.91,59.89 28.78,60.76 v36.02,60.76
D0
  Top 0.229: J1.13 30.44,61.28 34.21,57.51 38.64,57.51 38.65,57.52 U$1.82
D1
  Top 0.229: J1.14 30.38,60.78 34.04,57.12 38.8,57.12 38.81,57.12 U$1.83
D2
  Top 0.229: J1.15 30.32,60.28 33.88,56.72 U$1.84
D3
  Top 0.229: J1.16 30.21,59.78 33.66,56.33 U$1.85
D4
  Top 0.229: J1.17 30.03,59.28 33.38,55.92 U$1.86
D5
  Top 0.229: J1.18 29.87,58.78 33.12,55.53 U$1.87
D6
  Top 0.229: J1.19 29.71,58.28 32.86,55.12 U$1.88
D7
  Top 0.229: J1.20 29.52,57.78 32.57,54.73 U$1.89
EP-STV  (via drill 0.35)
  Top 0.229: J1.29 26.69,53.28 28.85,55.45 v28.85,56.72 | v35.08,59.94 35.08,61.11 35.89,61.93 U$1.71
  Bottom 0.229: v28.85,56.72 28.85,59.08 29.72,59.94 v35.08,59.94
EP-VCOM  (via drill 0.35)
  Top 0.254: J1.21 25.73,57.28 25.96,57.05 v27.1,57.05 | v82.85,54.53 85.04,54.53 85.7,55.2 U2.15
  Bottom 0.254: v27.1,57.05 27.1,65.86 29.57,68.33 67.69,68.33 81.53,54.48 82.8,54.48 v82.85,54.53
EPD-VDD
  Top 0.203: 83.62,66.4 83.62,65.53 85.7,63.45 U2.46
  Top 0.254: J1.6 23.98,64.78 25.76,66.56 C26.1 26.92,66.56 29.63,69.27 80.75,69.27 83.62,66.4
GND  (via drill 0.35, 0.4)  (3 unrouted)
  Top 0.203: v90.99,54.11 90.99,51.24 92.63,49.61 94.04,49.61 L1.2 96.18,49.72 96.29,49.83 96.29,52.58 C18.1 | R11.2 95.91,63.41 | 95.91,63.41 97.28,63.41 97.33,63.46 | U2.32 93.52,60.36 93.68,60.52 93.68,60.66 94.08,61.06 C22.1 94.98,62.51 95.61,62.51 95.91,62.81 95.91,63.41 | R13.1 90.56,71.08 | v96.93,67.65 97.33,67.25 C19.2 | 91.46,67.25 C25.2 | 76.68,64.69 76.96,64.41 78.09,64.41 C7.1 78.3,65.16 78.59,65.46 80.75,65.46 81.28,64.92 81.28,64.26 81.75,63.79 C23.1 83.2,63.79 83.95,63.04 U2.48 | 91.74,66.94 C25.2 | 85.17,23.62 85.17,23.16 84.8,22.8 84.8,22.57 85.19,22.17 85.65,22.17 85.69,22.13 85.74,22.13 86.18,21.69 86.18,21.26 86.13,21.21 86.13,20.32 86.39,20.06 | C14.1 78.04,60.89 C15.1 | C20.2 88.37,70.69 | 88.37,70.69 90.18,70.69 R13.1 | v88.9,68.63 88.72,68.81 C6.1 87.62,69.94 88.37,70.69 | R13.1 91.86,69.01 C24.2 91.86,67.36 C25.2 | U2.41 88.2,64.3 v88.19,64.31 | 34.06,47.14 34.06,47.27 35.66,48.87 41.66,48.87 | 24.17,51.78 24.13,51.78
  Top 0.229: v76.66,65.4 76.68,65.38 76.68,64.69 | C26.2 v35.19,64.76 37.59,67.16 41.4,67.16 41.75,66.81 U$1.61 | U$1.125 51.75,49.44 51.33,49.02 | U$1.120 49.75,48.5 v49.99,48.26 50.57,48.26 51.33,49.02 | U$1.128 52.95,49.34 52.63,49.02 51.33,49.02 | U$1.21 55.69,59.93 55.7,59.92 56.54,59.92 v56.59,59.97 | U$1.37 51.35,64.48 v51.33,64.46 | U$1.76 40.88,59.93 v41.33,59.49 | v40.56,51.82 40.55,51.8 U$1.97 40.55,49.04 40.72,48.87 41.66,48.87 43.82,48.87 46.38,48.87 46.95,49.44 U$1.113 | U$1.104 43.35,49.33
  Top 0.25: C16.1 84.24,48.7 87.22,45.72 87.22,44.65
  Top 0.254: 92.12,22.96 91.46,23.62 90.37,23.62 90.33,23.58 89.97,23.58 | 89.97,23.58 R3.2 87.72,24.1 85.65,24.1 85.17,23.62 | 21.95,54.41 21.95,52.15 22.31,51.78 J1.32 24.13,51.78 33.11,51.78 34.06,50.83 34.06,47.14 | J1.26 22.32,54.78 21.95,54.41 | J1.3 22.26,66.28 22.05,66.07 22.05,64.46 | 22.05,64.46 22.23,64.28 J1.7 24.53,64.28 25.01,64.76 C26.2 | J1.9 22.56,63.27 22.05,63.79 | 22.05,63.79 22.05,64.46 | 21.95,54.41 21.95,63.68 22.05,63.79 | 82.24,58.86 80.92,58.86 C10.2 C9.2 78.04,58.37 C14.1 | 82.24,58.86 U2.8 | U2.6 81.63,59.86 81.4,60.09 81.38,60.09 v81.36,60.07 80.94,60.07 79.93,61.07 C8.2 C15.1 | C11.2 82.74,52.81 C13.1 84.01,51.34 v84.53,50.83 84.24,50.53 C16.1 84.21,49.4 83.03,49.4 82.52,48.89 82.55,48.87 82.55,43.74 80.77,41.96 77.29,41.96 | C12.2 81.55,52.17 C11.2 | v90.99,54.11 90.99,53.82 | 97.33,63.46 C19.2 | U2.14 85.2,55.56 84.89,55.24 83.49,55.24 82.68,56.06 | 82.68,56.06 v82.68,56.11 | v81.94,58.09 81.94,58.56 82.24,58.86 | C11.2 81.55,54.93 82.68,56.06 | L1.2 90.53,49.72 88.85,48.05 88.85,33.15 | 89.43,24.12 89.97,23.58 | 78.74,30.47 80.01,30.47 84.42,30.47 87.22,33.27 87.22,44.65 | 43.35,49.33 43.82,48.87
  Top 0.305: 88.85,33.15 88.85,32.28 90.87,30.26 95.06,30.26
  Top 0.406: 80.33,22 C4.2
  Top 0.457: J4.2 95.06,30.26 96.83,28.5
  Bottom 0.203: 96.86,66.69 96.86,67.58 v96.93,67.65 | v88.19,64.31 88.9,65.02 v88.9,68.63
  Bottom 0.229: v75.62,44.86 75.62,46.15 75.01,46.76 v71.42,46.76 71.27,46.91 71.17,46.91 70.05,48.03 59.56,48.03 v59.13,48.46 50.19,48.46 v49.99,48.26 49.99,52.07 49.76,52.3 | v56.59,59.97 55.63,59 52.27,59 | 52.27,59 49.76,56.49 49.76,52.3 | v51.33,64.46 52.27,63.53 52.27,59 | v35.19,64.76 43.12,64.76 43.94,63.93 43.94,60.48 42.95,59.49 v41.33,59.49 41.33,52.58 | v40.56,51.82 41.33,52.58 | 41.33,52.58 41.81,53.06 49,53.06 49.76,52.3
  Bottom 0.254: v88.9,68.63 90.6,68.63 92.43,66.8 96.75,66.8 96.86,66.69 96.98,66.57 96.98,54.3 96.79,54.11 v90.99,54.11 90.3,53.42 88.95,53.42 86.36,50.83 v84.53,50.83 | v76.66,65.4 77.65,65.4 78.61,64.44 79.83,63.22 79.83,61.57 81.33,60.07 v81.36,60.07 | v82.68,56.11 81.94,56.84 v81.94,58.09
H-CS
  Top 0.254: U$1.115 47.75,48.61
H-MISO
  Top 0.229: 48.95,47.89 U$1.118
H-MOSI
  Top 0.229: U$1.117 48.56,48.18
H-SCK
  Top 0.229: U$1.116 48.16,50.19 48.16,50.18 48.16,48.45
I2C1-SCL  (via drill 0.35)
  Top 0.254: U2.17 86.7,52.98 87.86,51.82 87.86,33.07 84.72,29.93 76.47,29.93 75.53,28.99 R8.1 75.43,26.29 v73.89,26.29
  Bottom 0.254: v73.89,26.29 73.02,26.29 71.53,24.79
I2C1-SDA  (via drill 0.35)
  Top 0.254: U2.18 87.2,53.18 88.34,52.04 88.34,32.82 84.78,29.26 76.81,29.26 76.4,28.85 76.4,27.01 76.4,25.48 R9.1 75.73,24.92 v73.89,24.92
  Bottom 0.254: 72.03,24.05 72.9,24.92 v73.89,24.92
N$6
  Top 0.305: J5.1 62.28,6.1 61.85,6.53 R4.2
N$9
  Top 0.305: J5.2 59.39,5.97 60.22,6.81 60.22,7.66 R7.2
N$12
  Top 0.203: C7.2 80.09,64.62 82.35,62.36 U2.1
N$13
  Top 0.25: U2.4 81.86,60.86 80.8,61.92 79.07,61.92 C15.2
N$14
  Top 0.254: U2.7 80.46,59.36 80.29,59.54 C14.2
N$15
  Top 0.203: 90.89,55.38 90.89,55.29 91.85,54.33 91.85,51.97 92.43,51.38 94.02,51.38 L1.1 94.41,51.52 94.41,53.82 95.69,55.09 D4.C
  Top 0.254: U2.25 90.89,55.38
N$16
  Top 0.254: U2.28 90.9,58.37 92.18,58.37 93.81,56.74 C17.1
N$17
  Top 0.203: C17.2 96.07,56.74 96.55,56.27 96.55,55.47 97.31,54.71 97.48,54.71 D7.C
  Top 0.254: D6.A 96.04,57.95 95.62,57.53 C17.2
N$19
  Top 0.203: U2.36 91.73,62.36 92.86,63.5 92.86,65.73 93.94,66.82 C21.1
P30
  Top 0.203: 92.33,59.36 93.01,59.36 93.29,59.08 93.8,59.08 93.83,59.11 95.18,59.11 96.04,59.97 D6.C 97.16,60.38 97.33,60.55 C19.1
  Top 0.254: U2.30 92.33,59.36
P31
  Top 0.203: R10.2 95.73,61.3 R11.1
  Top 0.254: U2.31 94.29,59.86 R10.2
P33  (via drill 0.35)
  Top 0.203: U2.33 92.4,60.86 v92.53,61 | v92.07,63.63 92.48,64.03 92.48,65.89 92.84,66.24 92.84,69.56 R12.1 93.64,70.56 R13.2
  Bottom 0.203: v92.53,61 92.53,63.17 v92.07,63.63
P34
  Top 0.203: U2.34 91.94,61.36 92.97,62.39 93.45,62.39 94.08,63.02 C22.2 D9.A
P36
  Top 0.203: D9.C 96.38,66.53 C21.2 96.37,67.98 96.37,68.21 D8.A
P37
  Top 0.165: C25.1 91.74,64.77 91.08,64.11 90.47,64.11 90.2,63.84 90.2,63.66
  Top 0.203: U2.42 U2.43 87.2,63.88 85.45,65.62 85.45,67.14 85.5,67.18 85.5,67.31 85.98,67.79 89.82,67.79 90.1,67.51 | 90.17,63.08 U2.37 90.2,63.66 | C24.1 90.1,67.51 | 90.1,67.51 D10.C | D10.C 90.3,67.44 | 91.74,65.2 C25.1 91.38,65.55 90.93,65.99 90.93,66.68 D10.C
P40
  Top 0.203: U2.40 88.7,63.63 89.05,63.98 89.05,65.3 88.83,65.52 L2.2 90.17,65.26 D10.A
UART0-RX
  Top 0.254: 60.05,9.53 R7.1
  Top 0.305: R7.1 60.15,12.1
UART0-TX
  Top 0.305: R4.1 61.85,10.44 61.05,11.23
VBAT  (via drill 0.4)
  Top 0.254: C4.1 82.41,20.52 v83.46,20.52
  Top 0.406: C4.1 83.01,21.88 Q1.2
  Top 0.457: v92.23,32.97 94.89,32.97 J4.1
  Bottom 0.254: v83.46,20.52 89.86,26.92 90.63,26.92 91.69,27.99 91.69,32.44 v92.23,32.97
VBUS  (1 unrouted)
  Top 0.254: 94.06,26.57 94.95,25.67 94.95,21.88 94.72,21.64 | 94.06,26.57 93.8,26.82 | 94.14,22.21 94.72,21.64 | 94.72,21.64 94.72,18.11 94.12,17.51 92.73,17.51 | 91.78,22.21 91.29,22.71 89.06,22.71 R3.1 87.42,21.88 Q1.3 | D1.A 87.46,27.43 93.19,27.43 94.06,26.57
VIN  (via drill 0.35)  (1 unrouted)
  Top 0.203: 84.89,24.81 Q1.1 82.89,23.78 82.18,24.5 | 78.46,54.91 78.23,54.69 v78.23,54.53 78.31,54.61 C9.1
  Top 0.254: 78.23,56.22 C9.1 | C9.1 C10.1 81.9,56.3 83.47,57.86 U2.10 | 78.46,54.91 79.55,54.91 79.74,54.72 C11.1 79.74,52.17 C12.1 79.72,50.84 81.22,49.34 | U2.24 90.2,51.31 90.14,51.26 v90.14,51.21 | v81.25,49.38 81.22,49.34 | v86.08,66.88 86.36,66.6 L2.1 | C9.1 77.73,56.3 75.49,58.55 75.49,65.91 v75.89,66.32 81.6,66.32 C23.2 | 87.38,24.81 84.89,24.81 | v79.27,26.34 79.45,26.52 80.11,26.52 80.37,26.77 D1.C 82.5,25.11 81.89,24.5 | 81.23,49.17 81.23,49.33 81.22,49.34
  Top 0.305: 81.05,49.35 81.23,49.17 | 27.3,3.01 28.42,1.89 74.61,1.89 77.19,4.47 77.19,8.1 v77.67,8.58
  Bottom 0.254: v78.23,54.53 78.23,30.99 79.63,29.59 79.63,27.58 79.27,27.23 v79.27,26.34 | v90.14,51.21 90.14,50.88 88.59,49.33 81.3,49.33 v81.25,49.38 | v86.08,66.88 85.72,66.52 84.78,66.52 80.01,66.52 79.81,66.32 v75.89,66.32
  Bottom 0.305: v79.27,26.34 79.27,24.86 77.8,23.39 77.8,8.71 v77.67,8.58
VNEG-IN  (via drill 0.35, 0.4)
  Top 0.203: 92.49,55.2 92.6,55.09 D4.A
  Top 0.254: U2.16 86.2,54.45 v85.79,54.04 85.71,53.96 C13.2 85.71,49.61 C16.2 | U2.26 U2.27 | U2.22 89.2,55.14 v89.18,55.12 | U2.26 | U2.26 91.8,57.36 v92.2,56.96 92.2,55.49 92.49,55.2
  Bottom 0.25: v89.18,55.12 88.1,54.04 v85.79,54.04
  Bottom 0.254: v89.18,55.12 89.26,55.04 91.62,55.04 92.3,55.73 92.3,56.86 v92.2,56.96
XCL  (via drill 0.35)
  Top 0.229: v43.05,63.4 45.35,61.1 U$1.109
  Top 0.254: J1.8 23.22,63.75 v34.11,63.75
  Bottom 0.229: v34.11,63.75 34.29,63.58 42.88,63.58 v43.05,63.4
XLE  (via drill 0.35)
  Top 0.229: J1.10 24.6,62.78 v24.74,62.92 | v44.31,52.04 44.55,51.8 U$1.107
  Bottom 0.229: v24.74,62.92 24.74,51.87 25.86,50.75 43.02,50.75 v44.31,52.04
XOE
  Top 0.229: J1.11 31.49,62.28 31.5,62.28 32.39,62.28 33.63,61.04 33.63,59.59 33.98,59.23 36.96,59.23 37.26,59.54 U$1.77
XSTL  (via drill 0.35)
  Top 0.229: U$1.108 44.95,60.18 v42.37,62.76 | v31.8,61.52 31.55,61.77 27.33,61.77
  Top 0.254: 27.33,61.77 J1.12
  Bottom 0.229: v31.8,61.52 34.39,61.52 35.64,62.76 v42.37,62.76

### Text on the board
tPlace: UART | RX-TX
tNames: charge module / output 5v | - +